# EAGLE design Voicecard-4P-v01 (EAGLE 5.09)
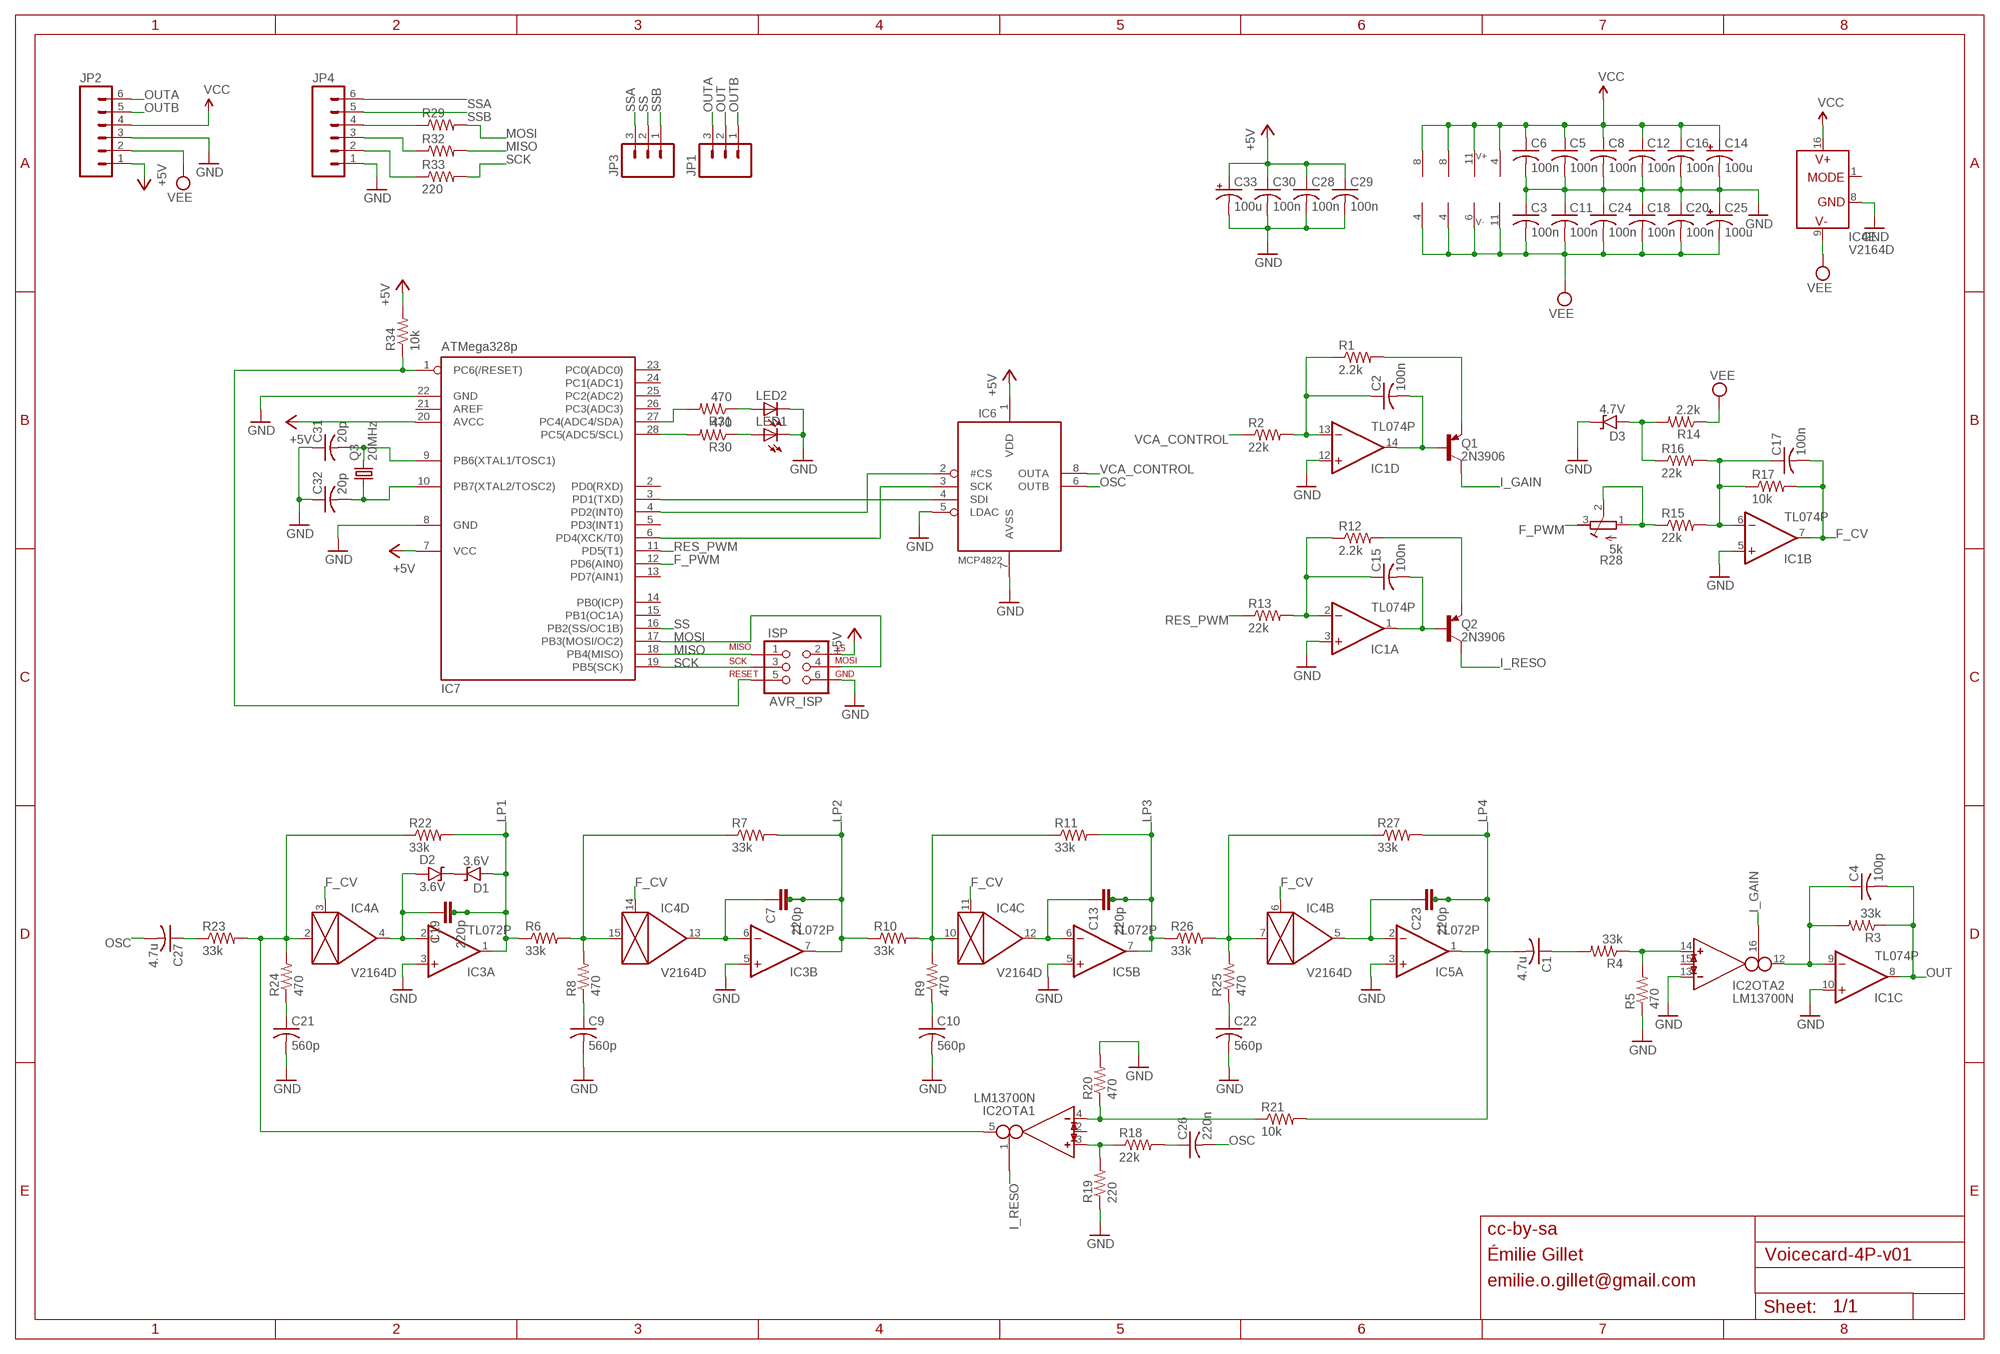
[diagram p0: schematic, sheet 1]

## Parts
C1  4.7u  C-US  [ENP11-6.3]
C2  100n  C-US025-025X050  [C025-025X050]
C3  100n  C-US025-025X050  [C025-025X050]
C4  100p  C-US025-025X050  [C025-025X050]
C5  100n  C-US025-025X050  [C025-025X050]
C6  100n  C-US025-025X050  [C025-025X050]
C7  220p  C-2.5-5/4  [C2.5/5-4]
C8  100n  C-US025-025X050  [C025-025X050]
C9  560p  C-US025-025X050  [C025-025X050]
C10  560p  C-US025-025X050  [C025-025X050]
C11  100n  C-US025-025X050  [C025-025X050]
C12  100n  C-US025-025X050  [C025-025X050]
C13  220p  C-2.5-5/4  [C2.5/5-4]
C14  100u  CPOL-USE2.5-6  [E2,5-6]
C15  100n  C-US025-025X050  [C025-025X050]
C16  100n  C-US025-025X050  [C025-025X050]
C17  100n  C-US025-025X050  [C025-025X050]
C18  100n  C-US025-025X050  [C025-025X050]
C19  220p  C-2.5-5/4  [C2.5/5-4]
C20  100n  C-US025-025X050  [C025-025X050]
C21  560p  C-US025-025X050  [C025-025X050]
C22  560p  C-US025-025X050  [C025-025X050]
C23  220p  C-2.5-5/4  [C2.5/5-4]
C24  100n  C-US025-025X050  [C025-025X050]
C25  100u  CPOL-USE2.5-6  [E2,5-6]
C26  220n  C-US025-025X050  [C025-025X050]
C27  4.7u  C-US  [ENP11-6.3]
C28  100n  C-US025-025X050  [C025-025X050]
C29  100n  C-US025-025X050  [C025-025X050]
C30  100n  C-US025-025X050  [C025-025X050]
C31  20p  C-US025-025X050  [C025-025X050]
C32  20p  C-US025-025X050  [C025-025X050]
C33  100u  CPOL-USE2.5-6  [E2,5-6]
D1  3.6V  1N47XXDO35  [D-5]
D2  3.6V  1N47XXDO35  [D-5]
D3  4.7V  1N47XXDO35  [D-5]
IC1  TL074P  [DIL14]
IC2  LM13700N  [DIL16]
IC3  TL072P  [DIL08]
IC4  V2164D  SSM2164P  [DIL16]
IC5  TL072P  [DIL08]
IC6  MCP4822  [DIL08]
IC7  ATMega328p  MEGA8-P  [DIL28-3]
ISP  AVR_ISP  AVR_SPI_PRG_6PTH  [2X3]
JP1  M03PTH  [1X03]
JP2  M06SIP  [1X06]
JP3  M03PTH  [1X03]
JP4  M06SIP  [1X06]
LED1  LED3MM  [LED3MM]
LED2  LED3MM  [LED3MM]
Q1  2N3906  2N3906-  [TO92-]
Q2  2N3906  2N3906-  [TO92-]
Q3  20MHz  CRYSTALHC49U-V  [HC49U-V]
R1  2.2k  R-US_0204/7  [0204/7]
R2  22k  R-US_0204/7  [0204/7]
R3  33k  R-US_0204/7  [0204/7]
R4  33k  R-US_0204/7  [0204/7]
R5  470  R-US_0204/7  [0204/7]
R6  33k  R-US_0204/7  [0204/7]
R7  33k  R-US_0204/7  [0204/7]
R8  470  R-US_0204/7  [0204/7]
R9  470  R-US_0204/7  [0204/7]
R10  33k  R-US_0204/7  [0204/7]
R11  33k  R-US_0204/7  [0204/7]
R12  2.2k  R-US_0204/7  [0204/7]
R13  22k  R-US_0204/7  [0204/7]
R14  2.2k  R-US_0204/7  [0204/7]
R15  22k  R-US_0204/7  [0204/7]
R16  22k  R-US_0204/7  [0204/7]
R17  10k  R-US_0204/7  [0204/7]
R18  22k  R-US_0204/7  [0204/7]
R19  220  R-US_0204/7  [0204/7]
R20  470  R-US_0204/7  [0204/7]
R21  10k  R-US_0204/7  [0204/7]
R22  33k  R-US_0204/7  [0204/7]
R23  33k  R-US_0204/7  [0204/7]
R24  470  R-US_0204/7  [0204/7]
R25  470  R-US_0204/7  [0204/7]
R26  33k  R-US_0204/7  [0204/7]
R27  33k  R-US_0204/7  [0204/7]
R28  5k  R-TRIMM3296P  [RTRIM3296P]
R29  220  R-US_0204/7  [0204/7]
R30  470  R-US_0204/7  [0204/7]
R31  470  R-US_0204/7  [0204/7]
R32  220  R-US_0204/7  [0204/7]
R33  220  R-US_0204/7  [0204/7]
R34  10k  R-US_0204/7  [0204/7]

## Nets
+5V: C28.1 C29.1 C30.1 C33.+ IC6.1(VDD) IC7.7(VCC) IC7.20(AVCC) ISP.2 JP2.1 R34.2
CAP_IN: C19.1 D2.A IC3.2(A:-IN) IC4.4(A:OUT)
F_CV: C17.2 IC1.7(B:OUT) IC4.3(A:CTRL) IC4.6(B:CTRL) IC4.11(C:CTRL) IC4.14(D:CTRL) R17.2
F_PWM: IC7.12(PD6(AIN0)) R28.3(A)
GND: C3.1 C5.2 C6.2 C8.2 C9.2 C10.2 C11.1 C12.2 C14.- C16.2 C18.1 C20.1 C21.2 C22.2 C24.1 C25.+ C28.2 C29.2 C30.2 C31.1 C32.1 C33.- D3.C IC1.3(A:+IN) IC1.5(B:+IN) IC1.10(C:+IN) IC1.12(D:+IN) IC2.13(OTA2:IN_N) IC3.3(A:+IN) IC3.5(B:+IN) IC4.8(E:GND) IC5.3(A:+IN) IC5.5(B:+IN) IC6.5(LDAC) IC6.7(AVSS) IC7.8(GND) IC7.22(GND) ISP.6 JP2.3 JP4.1 LED1.K(C) LED2.K(C) R5.1 R19.1 R20.2
I_GAIN: IC2.16(OTA2:I_BIAS) Q1.1(C)
I_RESO: IC2.1(OTA1:I_BIAS) Q2.1(C)
LEDS0: IC7.28(PC5(ADC5/SCL)) R30.2
LP1: C19.2 C19.3 D1.A IC3.1(A:OUT) R6.1 R22.2
LP2: C7.2 C7.3 IC3.7(B:OUT) R7.2 R10.1
LP3: C13.2 C13.3 IC5.7(B:OUT) R11.2 R26.1
LP4: C1.- C23.2 C23.3 IC5.1(A:OUT) R21.2 R27.2
MISO: IC7.18(PB4(MISO)) ISP.1 R32.2
MOSI: IC7.17(PB3(MOSI/OC2)) ISP.4 R29.2
N$1: C27.+ R23.1
N$2: C1.+ R4.2
N$3: IC6.4(SDI) IC7.3(PD1(TXD))
N$5: C21.1 R24.1
N$7: LED1.A R30.1
N$8: JP4.2 R33.1
N$9: D3.A R14.2 R16.1
N$10: LED2.A R31.1
N$11: IC7.27(PC4(ADC4/SDA)) R31.2
N$12: C7.1 IC3.6(B:-IN) IC4.13(D:OUT)
N$13: JP4.3 R32.1
N$14: IC7.1(PC6(/RESET)) ISP.5 R34.1
N$15: IC6.3(SCK) IC7.6(PD4(XCK/T0))
N$16: IC6.2(#CS) IC7.4(PD2(INT0))
N$17: C13.1 IC4.12(C:OUT) IC5.6(B:-IN)
N$18: JP4.4 R29.1
N$19: IC4.10(C:IN) R9.2 R10.2 R11.1
N$20: C10.1 R9.1
N$21: C22.1 R25.1
N$22: IC4.7(B:IN) R25.2 R26.2 R27.1
N$23: C23.1 IC4.5(B:OUT) IC5.2(A:-IN)
N$26: C9.1 R8.1
N$29: C2.2 IC1.14(D:OUT) Q1.2(B)
N$30: C15.2 IC1.1(A:OUT) Q2.2(B)
N$32: IC2.4(OTA1:IN_N) R20.1 R21.1
N$33: IC2.5(OTA1:OUT) IC4.2(A:IN) R22.1 R23.2 R24.2
N$34: IC2.3(OTA1:IN_P) R18.1 R19.2
N$36: C26.1 R18.2
N$37: IC2.14(OTA2:IN_P) R4.1 R5.2
N$40: C17.1 IC1.6(B:-IN) R15.2 R16.2 R17.1
N$41: R15.1 R28.1(E) R28.2(S)
N$42: D1.C D2.C
N$43: IC4.15(D:IN) R6.2 R7.1 R8.2
N$51: C15.1 IC1.2(A:-IN) R12.1 R13.2
N$57: C2.1 IC1.13(D:-IN) R1.1 R2.2
N$60: Q1.3(E) R1.2
N$68: Q2.3(E) R12.2
N$70: C4.1 IC1.9(C:-IN) IC2.12(OTA2:OUT) R3.2
N$82: C32.2 IC7.10(PB7(XTAL2/TOSC2)) Q3.1
N$83: C31.2 IC7.9(PB6(XTAL1/TOSC1)) Q3.2
OSC: C26.2 C27.- IC6.6(OUTB)
OUT: C4.2 IC1.8(C:OUT) JP1.2 R3.1
OUTA: JP1.3 JP2.6
OUTB: JP1.1 JP2.5
RES_PWM: IC7.11(PD5(T1)) R13.1
SCK: IC7.19(PB5(SCK)) ISP.3 R33.2
SS: IC7.16(PB2(SS/OC1B)) JP3.2
SSA: JP3.3 JP4.6
SSB: JP3.1 JP4.5
VCA_CONTROL: IC6.8(OUTA) R2.1
VCC: C5.1 C6.1 C8.1 C12.1 C14.+ C16.1 IC1.4(P:V+) IC2.11(SUPPLY:V+) IC3.8(P:V+) IC4.16(E:V+) IC5.8(P:V+) JP2.4
VEE: C3.2 C11.2 C18.2 C20.2 C24.2 C25.- IC1.11(P:V-) IC2.6(SUPPLY:V-) IC3.4(P:V-) IC4.9(E:V-) IC5.4(P:V-) JP2.2 R14.1
Unconnected: IC2.2(OTA1:I_DIODE) IC2.7(BUF1:B) IC2.8(BUF1:E) IC2.9(BUF2:E) IC2.10(BUF2:B) IC2.15(OTA2:I_DIODE) IC4.1(E:MODE) IC7.2(PD0(RXD)) IC7.5(PD3(INT1)) IC7.13(PD7(AIN1)) IC7.14(PB0(ICP)) IC7.15(PB1(OC1A)) IC7.21(AREF) IC7.23(PC0(ADC0)) IC7.24(PC1(ADC1)) IC7.25(PC2(ADC2)) IC7.26(PC3(ADC3))

## Notes on the sheet
- cc-by-sa
- Émilie Gillet
- emilie.o.gillet@gmail.com

## Library data of the parts
C1 C27 = og-rcl:C-US
C2-C6 C8-C12 C15-C18 C20-C22 C24 C26 C28-C32 = rcl:C-US: CAPACITOR, American symbol
C7 C13 C19 C23 = capacitor-wima:C-: CAPACITOR for alternative placement naming: default grid - extended grid/package width
C14 C25 C33 = rcl:CPOL-US: POLARIZED CAPACITOR, American symbol
D1-D3 = og-diodes:1N47XX: Zener Diode 1N4728 - 1N4764: 3.3 V - 100V, 10% (1n47xxA 5%); DO-41 glass case
IC1 = linear:TL074: OP AMP
IC2 = ota:LM13700: Dual OTA with buffers
IC3 IC5 = og-linear:TL072: OP AMP
IC4 = ssm2164:SSM2164
IC6 = og-dac:MCP4822
IC7 = atmel:MEGA8-P: MICROCONTROLLER 8 Kbytes FLASH, 1 kbytes SRAM, 512 bytes EEPROM, USART, 4-channel 10 bit ADC, 2-channel 8 bit ADC Pin compatible with Atmega48, ATMega88, ATMega168 Source: avr.lbr
ISP = SparkFun:AVR_SPI_PRG_6: AVR ISP 6 Pin This is the reduced ISP connector for AVR programming. Common on Arduino. This footprint will take up less PCB space and can be used with a 10-pin to 6-pin adapter such as SKU: BOB-08508
JP1 JP3 = SparkFun:M03: Header 3 Standard 3-pin 0.1" header. Use with straight break away headers (SKU : PRT-00116), right angle break away headers (PRT-00553), swiss pins (PRT-00743), machine pins (PRT-00117), and female headers (PRT-00115). Molex polarized connector foot print use with SKU : PRT-08232 with associated crimp pins and housings.
JP2 JP4 = SparkFun:M06: Header 6 Standard 6-pin 0.1" header. Use with straight break away headers (SKU : PRT-00116), right angle break away headers (PRT-00553), swiss pins (PRT-00743), machine pins (PRT-00117), and female headers (PRT-00115). Molex polarized connector foot print use with SKU : PRT-08094 with associated crimp pins and housings. NOTES ON THE VARIANTS LOCK and LOCK_LONGPADS... This footprint was designed to help hold the alignment of a through-hole component (i.e. 6-pin header) while soldering it into place. You may notice that each hole has been shifted either up or down by 0.005 of an inch from it's more standard position (which is a perfectly straight line). This slight alteration caused the pins (the squares in the middle) to touch the edges of the holes. Because they are alternating, it causes a "brace" to hold the component in place. 0.005 has proven to be the perfect amount of "off-center" position when using our standard breakaway headers. Although looks a little odd when you look at the bare footprint, once you have a header in there, the alteration is very hard to notice. Also, if you push a header all the way into place, it is covered up entirely on the bottom side. This idea of altering the position of holes to aid alignment will be further integrated into the Sparkfun Library for other footprints. It can help hold any component with 3 or more connection pins.
LED1 LED2 = led:LED: LED OSRAM: - CHIPLED LG R971, LG N971, LY N971, LG Q971, LY Q971, LO R971, LY R971 LH N974, LH R974 LS Q976, LO Q976, LY Q976 LO Q996 - Hyper CHIPLED LW Q18S LB Q993, LB Q99A, LB R99A - SideLED LS A670, LO A670, LY A670, LG A670, LP A670 LB A673, LV A673, LT A673, LW A673 LH A674 LY A675 LS A676, LA A676, LO A676, LY A676, LW A676 LS A679, LY A679, LG A679 - Hyper Micro SIDELED® LS Y876, LA Y876, LO Y876, LY Y876 LT Y87S - SmartLED LW L88C, LW L88S LB L89C, LB L89S, LG L890 LS L89K, LO L89K, LY L89K LS L896, LA L896, LO L896, LY L896 - TOPLED LS T670, LO T670, LY T670, LG T670, LP T670 LSG T670, LSP T670, LSY T670, LOP T670, LYG T670 LG T671, LOG T671, LSG T671 LB T673, LV T673, LT T673, LW T673 LH T674 LS T676, LA T676, LO T676, LY T676, LB T676, LH T676, LSB T676, LW T676 LB T67C, LV T67C, LT T67C, LS T67K, LO T67K, LY T67K, LW E67C LS E67B, LA E67B, LO E67B, LY E67B, LB E67C, LV E67C, LT E67C LW T67C LS T679, LY T679, LG T679 LS T770, LO T770, LY T770, LG T770, LP T770 LB T773, LV T773, LT T773, LW T773 LH T774 LS E675, LA E675, LY E675, LS T675 LS T776, LA T776, LO T776, LY T776, LB T776 LHGB T686 LT T68C, LB T68C - Hyper Mini TOPLED® LB M676 - Mini TOPLED Santana® LG M470 LS M47K, LO M47K, LY M47K Source: http://www.osram.convergy.de LUXEON: - LUMILED® LXK2-PW12-R00, LXK2-PW12-S00, LXK2-PW14-U00, LXK2-PW14-V00 LXK2-PM12-R00, LXK2-PM12-S00, LXK2-PM14-U00 LXK2-PE12-Q00, LXK2-PE12-R00, LXK2-PE12-S00, LXK2-PE14-T00, LXK2-PE14-U00 LXK2-PB12-K00, LXK2-PB12-L00, LXK2-PB12-M00, LXK2-PB14-N00, LXK2-PB14-P00, LXK2-PB14-Q00 LXK2-PR12-L00, LXK2-PR12-M00, LXK2-PR14-Q00, LXK2-PR14-R00 LXK2-PD12-Q00, LXK2-PD12-R00, LXK2-PD12-S00 LXK2-PH12-R00, LXK2-PH12-S00 LXK2-PL12-P00, LXK2-PL12-Q00, LXK2-PL12-R00 Source: www.luxeon.com KINGBRIGHT: KA-3528ASYC Source: www.kingbright.com
Q1 Q2 = gm-trans:2N3906: PNP Transistor
Q3 = crystal:CRYSTAL: CRYSTAL
R1-R27 R29-R34 = rcl:R-US_: RESISTOR, American symbol
R28 = rcl:R-TRIMM: Trimm resistor

## Board
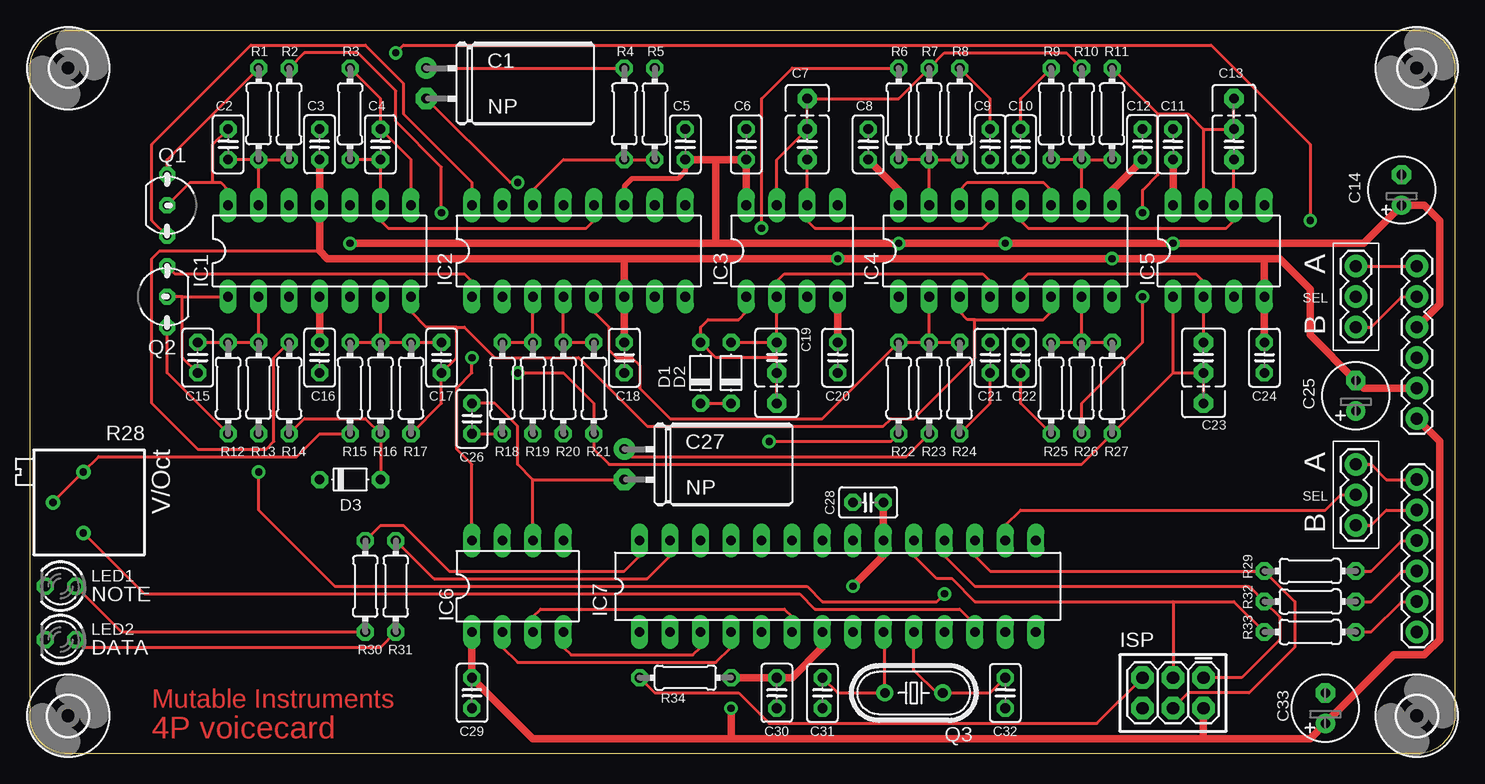
[diagram p1: board, top side]
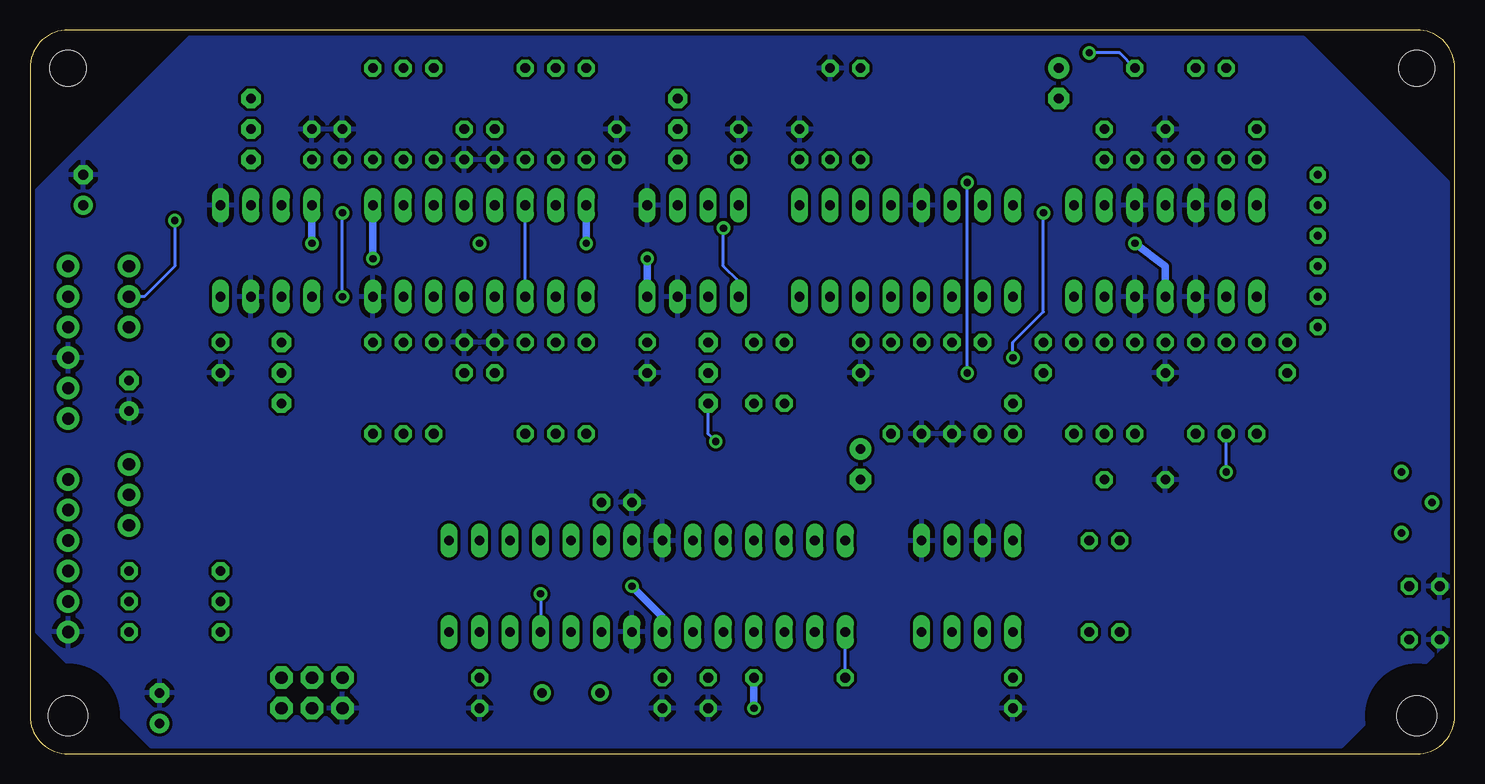
[diagram p2: board, bottom side, seen from below]

Size 118.75 x 60.33 mm. Coordinates in mm from the lower left corner, seen from the top.
Outline: 0,57.15 arc-90 3.18,60.33 115.57,60.33 arc-90 118.75,57.15 118.75,3.17 arc-90 115.57,0 3.18,0 arc-90 0,3.17 0,57.15
Copper layers (1*16): Top 0.035mm / dielectric 1.5mm / Bottom 0.035mm
Design rules "SparkFun *": minimum track width 8mil, minimum drill 20mil, track to track 8mil, track to pad 8mil, pad to pad 8mil, via to via 8mil, smd to smd 8mil, copper to edge 10mil, drill to drill 8mil, minimum pad ring 12mil, minimum via ring 10mil, stop-mask expansion 4mil, vias tented up to drill 25mil, thermal gap 16mil

### Footprints (pad centres in the part's own frame; a part is rotated, then mirrored left to right if it is on the bottom)
ENP11-6.3 = drill 0.813 pad 1.778 round: + -2.54,1.27 | drill 0.813 pad 1.778 octagon: - -2.54,-1.27
C025-025X050 = drill 0.813 octagon: 1 -1.27,0; 2 1.27,0
C2.5/5-4 = drill 0.813 pad 1.6 octagon: 1 -1.27,0; 2 1.27,0; 3 3.81,0
E2,5-6 = drill 0.813 pad 1.6 round: + -1.27,0 | drill 0.813 pad 1.6 octagon: - 1.27,0
D-5 = drill 0.813 octagon: A 2.54,0; C -2.54,0
DIL14 = drill 0.813 long: 1 -7.62,-3.81; 2 -5.08,-3.81; 3 -2.54,-3.81; 4 0,-3.81; 5 2.54,-3.81; 6 5.08,-3.81; 7 7.62,-3.81; 8 7.62,3.81; 9 5.08,3.81; 10 2.54,3.81; 11 0,3.81; 12 -2.54,3.81; 13 -5.08,3.81; 14 -7.62,3.81
DIL16 = drill 0.813 long: 1 -8.89,-3.81; 2 -6.35,-3.81; 3 -3.81,-3.81; 4 -1.27,-3.81; 5 1.27,-3.81; 6 3.81,-3.81; 7 6.35,-3.81; 8 8.89,-3.81; 9 8.89,3.81; 10 6.35,3.81; 11 3.81,3.81; 12 1.27,3.81; 13 -1.27,3.81; 14 -3.81,3.81; 15 -6.35,3.81; 16 -8.89,3.81
DIL08 = drill 0.813 pad 1.27 long: 1 -3.81,-3.81; 2 -1.27,-3.81; 3 1.27,-3.81; 4 3.81,-3.81; 5 3.81,3.81; 6 1.27,3.81; 7 -1.27,3.81; 8 -3.81,3.81
DIL08' = drill 0.813 long: 1 -3.81,-3.81; 2 -1.27,-3.81; 3 1.27,-3.81; 4 3.81,-3.81; 5 3.81,3.81; 6 1.27,3.81; 7 -1.27,3.81; 8 -3.81,3.81
DIL28-3 = drill 0.813 long: 1 -16.51,-3.81; 2 -13.97,-3.81; 3 -11.43,-3.81; 4 -8.89,-3.81; 5 -6.35,-3.81; 6 -3.81,-3.81; 7 -1.27,-3.81; 8 1.27,-3.81; 9 3.81,-3.81; 10 6.35,-3.81; 11 8.89,-3.81; 12 11.43,-3.81; 13 13.97,-3.81; 14 16.51,-3.81; 15 16.51,3.81; 16 13.97,3.81; 17 11.43,3.81; 18 8.89,3.81; 19 6.35,3.81; 20 3.81,3.81; 21 1.27,3.81; 22 -1.27,3.81; 23 -3.81,3.81; 24 -6.35,3.81; 25 -8.89,3.81; 26 -11.43,3.81; 27 -13.97,3.81; 28 -16.51,3.81
2X3 = drill 1.016 pad 1.88 octagon: 1 0,0; 2 0,2.54; 3 2.54,0; 4 2.54,2.54; 5 5.08,0; 6 5.08,2.54
1X03 = drill 1.016 pad 1.88 round: 1 0,0; 2 2.54,0; 3 5.08,0
1X06 = drill 1.016 pad 1.88 round: 1 0,0; 2 2.54,0; 3 5.08,0; 4 7.62,0; 5 10.16,0; 6 12.7,0
LED3MM = drill 0.813 octagon: A -1.27,0; K 1.27,0
TO92- = drill 0.7 octagon: 1 2.54,0; 2 0,0; 3 -2.54,0
HC49U-V = drill 0.813 round: 1 -2.413,0; 2 2.413,0
0204/7 = drill 0.813 octagon: 1 -3.81,0; 2 3.81,0
RTRIM3296P = drill 0.61 round: 1 0,-2.54; 2 2.54,0; 3 0,2.54
3,0 = hole 3: 0,0
3,3 = hole 3.3: 0,0

### Placement (x,y rotation side)
C1  35.56,55.88 0 top
C2  16.51,50.8 90 top
C3  24.13,50.8 270 top
C4  29.21,50.8 90 top
C5  54.61,50.8 90 top
C6  59.69,50.8 90 top
C7  64.77,50.8 90 top
C8  69.85,50.8 90 top
C9  80.01,50.8 270 top
C10  82.55,50.8 270 top
C11  92.71,50.8 270 top
C12  95.25,50.8 90 top
C13  100.33,50.8 90 top
C14  114.3,46.99 90 top
C15  13.97,33.02 270 top
C16  24.13,33.02 270 top
C17  34.29,33.02 270 top
C18  49.53,33.02 90 top
C19  62.23,33.02 270 top
C20  67.31,33.02 90 top
C21  80.01,33.02 90 top
C22  82.55,33.02 90 top
C23  97.79,33.02 270 top
C24  102.87,33.02 90 top
C25  110.49,29.84 90 top
C26  36.83,27.94 90 top
C27  52.07,24.13 0 top
C28  69.85,20.95 180 top
C29  36.83,5.08 270 top
C30  62.23,5.08 270 top
C31  66.04,5.08 90 top
C32  81.28,5.08 90 top
C33  107.95,3.81 90 top
D1  55.88,31.75 90 top
D2  58.42,31.75 90 top
D3  26.67,22.86 0 top
IC1  24.13,41.91 0 top
IC2  45.72,41.91 0 top
IC3  63.5,41.91 0 top
IC4  81.28,41.91 0 top
IC5  99.06,41.91 0 top
IC6  MCP4822  [DIL08']  40.64,13.97 0 top
IC7  67.31,13.97 0 top
ISP  97.79,6.35 180 top
JP1  110.49,35.56 90 top
JP2  115.57,27.94 90 top
JP3  110.49,19.05 90 top
JP4  115.57,10.16 90 top
LED1  2.54,13.97 180 top
LED2  2.54,9.53 180 top
Q1  11.43,45.72 270 top
Q2  11.43,38.1 90 top
Q3  73.66,5.08 180 top
R1  19.05,53.34 90 top
R2  21.59,53.34 270 top
R3  26.67,53.34 270 top
R4  49.53,53.34 90 top
R5  52.07,53.34 270 top
R6  72.39,53.34 270 top
R7  74.93,53.34 90 top
R8  77.47,53.34 270 top
R9  85.09,53.34 270 top
R10  87.63,53.34 270 top
R11  90.17,53.34 90 top
R12  16.51,30.48 270 top
R13  19.05,30.48 90 top
R14  21.59,30.48 270 top
R15  26.67,30.48 90 top
R16  29.21,30.48 90 top
R17  31.75,30.48 270 top
R18  39.37,30.48 270 top
R19  41.91,30.48 90 top
R20  44.45,30.48 270 top
R21  46.99,30.48 270 top
R22  72.39,30.48 270 top
R23  74.93,30.48 90 top
R24  77.47,30.48 90 top
R25  85.09,30.48 90 top
R26  87.63,30.48 90 top
R27  90.17,30.48 270 top
R28  4.45,20.95 180 top
R29  106.68,15.24 180 top
R30  27.94,13.97 90 top
R31  30.48,13.97 90 top
R32  106.68,12.7 180 top
R33  106.68,10.16 180 top
R34  54.61,6.35 0 top
U$1  [3,0]  3.18,57.15 0 top
U$2  [3,0]  115.57,57.15 0 top
U$4  [3,3]  3.18,3.17 0 top
U$5  [3,3]  115.57,3.17 0 top
U$6  [V2_LOGO_SMALL]  8.26,-3.81 0 top  (outside the outline)

### Tracks (layer width: path | path; a pad name or v marks a point on that pad's centre or on a via)
+5V  (via drill 0.6)
  Top 0.61: v68.58,13.97 71.12,16.51 IC7.20 C28.1 | 58.42,1.27 41.91,1.27 C29.1 IC6.1 | 58.42,1.27 97.79,1.27 | 97.79,1.27 106.68,1.27 C33.+ 113.67,8.26 116.2,8.26 117.48,9.53 117.48,26.04 JP2.1 | R34.2 C30.1 63.5,6.35 66.04,8.89 IC7.7 | 58.42,1.27 v58.42,3.81 | 97.79,1.27 ISP.2
  Bottom 0.61: v68.58,13.97 66.04,11.43 IC7.7 | v58.42,3.81 R34.2
CAP_IN
  Top 0.254: IC4.4 80.01,39.37 79.38,40.01 62.87,40.01 62.23,39.37 IC3.2 C19.1 D2.A
F_CV
  Top 0.254: IC1.7 31.75,36.83 33.02,35.56 35.56,35.56 | R17.2 34.29,29.21 C17.2 35.56,33.02 35.56,35.56 | IC4.11 85.09,46.99 84.45,47.62 78.11,47.62 77.47,46.99 IC4.14 | IC4.3 77.47,36.83 78.11,36.2 78.74,36.2 | 78.74,36.2 78.74,33.02 73.66,27.94 71.76,27.94 71.12,27.3 51.43,27.3 45.72,33.02 38.73,33.02 36.2,35.56 35.56,35.56 | IC4.6 85.09,36.83 84.45,36.2 78.74,36.2
  Bottom 0.254: IC4.3 IC4.14
F_PWM
  Top 0.254: IC7.12 78.74,10.79 77.47,12.06 65.41,12.06 64.14,13.34 9.53,13.34 R28.3
GND
  pour Bottom (isolate 0.254): 0.64,47.62 0.64,9.53 9.53,0.64 108.59,0.64 118.11,10.16 118.11,46.99 105.41,59.69 12.7,59.69
I_GAIN
  Top 0.254: Q1.1 10.16,44.45 10.16,50.8 18.41,59.05 27.94,59.05 31.11,55.88 31.11,53.34 36.83,47.62 IC2.16
I_RESO
  Top 0.254: IC2.1 36.83,39.37 36.2,40.01 12.07,40.01 Q2.1
LEDS0
  Top 0.254: R30.2 29.21,19.05 31.11,19.05 34.92,15.24 49.53,15.24 50.8,16.51 IC7.28
LP1  (via drill 0.6)
  Top 0.254: R6.1 63.5,57.15 60.96,54.61 v60.96,43.81 | C19.3 C19.2 62.23,33.02 57.15,33.02 D1.A 55.88,35.56 56.51,36.2 59.05,36.2 59.69,36.83 IC3.1 | R22.2 71.76,26.04 62.87,26.04 v61.59,26.04
  Bottom 0.254: v60.96,43.81 60.96,40.64 59.69,39.37 IC3.1 | v61.59,26.04 62.23,26.67 C19.3
LP2
  Top 0.254: IC3.7 62.23,49.53 C7.2 C7.3 72.39,54.61 R7.2 76.2,58.42 86.36,58.42 R10.1
LP3  (via drill 0.6)
  Top 0.254: C13.3 C13.2 97.79,52.07 | 97.79,52.07 IC5.7 | 93.98,53.34 R11.2 | 93.98,53.34 96.52,53.34 97.79,52.07 | R26.1 87.63,29.21 92.71,34.29 v92.71,38.1 | v92.71,45.09 92.71,46.99 93.98,48.26 93.98,53.34
  Bottom 0.254: v92.71,38.1 v92.71,45.09
LP4  (via drill 0.6)
  Top 0.254: C23.3 C23.2 95.25,31.75 | 95.25,31.75 IC5.1 | 95.25,31.75 R27.2 87.63,24.13 48.26,24.13 46.99,25.4 R21.2 46.99,29.21 44.45,31.75 v40.64,31.75 | C1.- 40,47.62 v40.64,47.62
  Bottom 0.254: v40.64,31.75 v40.64,47.62
MISO
  Top 0.254: IC7.18 76.2,16.51 78.74,13.97 101.6,13.97 R32.2 104.14,11.43 104.14,9.53 100.97,6.35 ISP.1
MOSI
  Top 0.254: IC7.17 78.74,16.51 80.01,15.24 R29.2 105.41,12.7 105.41,8.89 101.6,5.08 96.52,5.08 ISP.4
N$1
  Top 0.254: C27.+ 50.16,24.77 73.03,24.77 R23.1
N$2
  Top 0.254: C1.+ R4.2
N$3
  Top 0.254: IC7.3 55.88,8.89 55.24,8.26 45.08,8.26 44.45,8.89 IC6.4
N$5
  Top 0.254: C21.1 80.01,29.21 R24.1
N$7
  Top 0.254: R30.1 7.62,10.16 LED1.A
N$8
  Top 0.254: R33.1 111.76,10.16 114.3,12.7 JP4.2
N$9
  Top 0.254: R14.2 22.86,27.94 27.94,27.94 R16.1 D3.A
N$10
  Top 0.254: R31.1 29.21,8.89 4.45,8.89 LED2.A
N$11
  Top 0.254: R31.2 33.65,14.61 51.43,14.61 53.34,16.51 IC7.27
N$12
  Top 0.254: IC4.13 80.01,44.45 79.38,43.81 65.41,43.81 64.77,44.45 IC3.6 C7.1
N$13
  Top 0.254: R32.1 111.76,12.7 114.3,15.24 JP4.3
N$14
  Top 0.254: R34.1 52.07,5.08 59.05,5.08 61.59,2.54 88.9,2.54 ISP.5
  Bottom 0.254: R34.1 IC7.1
N$15
  Top 0.254: IC7.6 63.5,11.43 62.87,12.06 42.54,12.06 41.91,11.43 IC6.3
N$16
  Top 0.254: IC7.4 58.42,8.89 57.15,7.62 40.64,7.62 39.37,8.89 IC6.2
N$17
  Top 0.254: C13.1 IC5.6 100.33,44.45 99.7,43.81 83.19,43.81 82.55,44.45 IC4.12
N$18
  Top 0.254: R29.1 111.76,15.24 114.3,17.78 JP4.4
N$19
  Top 0.254: R10.2 R9.2 | R10.2 R11.1 | IC4.10 R10.2
N$20
  Top 0.254: R9.1 82.55,54.61 C10.1
N$21
  Top 0.254: C22.1 82.55,29.21 R25.1
N$22
  Top 0.254: R25.2 R26.2 | R26.2 R27.1 | R26.2 IC4.7
N$23
  Top 0.254: C23.1 IC5.2 97.79,39.37 97.16,40.01 83.19,40.01 82.55,39.37 IC4.5
N$26
  Top 0.254: R8.1 80.01,54.61 C9.1
N$29
  Top 0.254: IC1.14 16.51,46.99 15.88,47.62 15.24,47.62 | 15.24,47.62 15.24,50.8 C2.2 | Q1.2 13.34,47.62 15.24,47.62
N$30
  Top 0.254: C15.2 12.7,33.02 12.7,38.1 | 12.7,38.1 Q2.2 | 12.7,38.1 IC1.1
N$32
  Top 0.254: IC2.4 R20.1 R21.1
N$33
  Top 0.254: R23.2 IC4.2 | R23.2 R24.2 | R23.2 R22.1 66.04,27.94 53.34,27.94 50.8,30.48 50.8,32.38 50.16,33.02 48.89,33.02 48.26,33.66 48.26,35.56 46.99,36.83 IC2.5
N$34
  Top 0.254: R18.1 R19.2 IC2.3
N$36
  Top 0.254: C26.1 R18.2
N$37
  Top 0.254: R5.2 R4.1 44.45,49.53 41.91,46.99 IC2.14
N$40
  Top 0.254: R16.2 IC1.6 | R15.2 R16.2 | R16.2 R17.1 C17.1
N$41
  Top 0.254: R28.2 R28.1 5.71,24.77 22.23,24.77 24.13,26.67 R15.1
N$42
  Top 0.254: D1.C D2.C
N$43
  Top 0.254: R7.1 R6.2 | IC4.15 R7.1 | R7.1 R8.2
N$51
  Top 0.254: IC1.2 R13.2 R12.1 C15.1
N$57
  Top 0.254: IC1.13 R1.1 | R1.1 R2.2 | R1.1 C2.1
N$60
  Top 0.254: Q1.3 11.43,49.53 R1.2
N$68
  Top 0.254: R12.2 11.43,31.75 Q2.3
N$70
  Top 0.254: R3.2 C4.1 IC1.9 29.21,44.45 29.84,43.81 46.35,43.81 46.99,44.45 IC2.12
N$82
  Top 0.254: IC7.10 73.66,6.99 75.56,5.08 Q3.1 80.01,5.08 C32.2
N$83
  Top 0.254: IC7.9 71.25,10.03 Q3.2 67.31,5.08 C31.2
OSC
  Top 0.254: 41.91,22.86 C27.- | IC6.6 41.91,22.86 | C26.2 38.73,29.21 40.64,27.3 40.64,24.13 41.91,22.86
OUT  (via drill 0.6)
  Top 0.254: R3.1 29.21,54.61 C4.2 31.75,49.53 IC1.8 | v106.68,44.45 106.68,50.8 98.42,59.05 31.11,59.05 v30.48,58.42
  Bottom 0.254: JP1.2 109.22,38.1 106.68,40.64 v106.68,44.45 | v30.48,58.42 27.94,58.42 R3.1
OUTA
  Top 0.254: JP1.3 JP2.6
OUTB
  Top 0.254: JP1.1 111.76,35.56 114.3,38.1 JP2.5
RES_PWM  (via drill 0.6)
  Top 0.254: v76.2,13.34 75.56,12.7 66.04,12.7 64.77,13.97 25.4,13.97 19.05,20.32 v19.05,23.5
  Bottom 0.254: v76.2,13.34 IC7.11 | v19.05,23.5 R13.1
SCK
  Top 0.254: IC7.19 73.66,16.51 75.56,14.61 76.84,14.61 78.74,12.7 95.25,12.7 | 95.25,12.7 100.33,12.7 R33.2 | 95.25,12.7 ISP.3
SS
  Top 0.254: JP3.2 109.22,21.59 107.95,20.32 82.55,20.32 81.28,19.05 IC7.16
SSA
  Top 0.254: JP3.3 111.76,24.13 113.03,22.86 JP4.6
SSB
  Top 0.254: JP3.1 111.76,19.05 113.03,20.32 JP4.5
VCA_CONTROL  (via drill 0.6)
  Top 0.254: IC6.8 36.83,24.13 35.56,25.4 35.56,30.48 36.83,31.75 v36.83,33.02 | R2.1 22.86,58.42 27.3,58.42 30.48,55.24 30.48,52.7 34.29,48.9 v34.29,45.09
  Bottom 0.254: v36.83,33.02 36.83,34.29 34.29,36.83 v34.29,45.09
VCC  (via drill 0.6)
  Top 0.406: IC2.11 49.53,47.31 50.16,47.94 53.97,47.94 54.61,48.58 C5.1
  Top 0.61: JP2.4 117.48,37.47 117.48,44.45 116.2,45.72 C14.+ 111.12,42.55 v95.25,42.55 v81.28,42.55 v72.39,42.55 57.15,42.55 | C16.1 IC1.4 | IC5.8 C12.1 | C8.1 72.39,46.99 IC4.16 | IC3.8 C6.1 57.15,49.53 | v26.67,42.55 57.15,42.55 | 57.15,49.53 C5.1 | 57.15,42.55 57.15,49.53
  Bottom 0.61: v72.39,42.55 IC4.16 | v95.25,42.55 IC5.8 | v26.67,42.55 24.13,40.64 IC1.4
VEE  (via drill 0.6)
  Top 0.254: R14.1 20.32,33.02 20.32,26.04 19.68,25.4 13.97,25.4 10.16,29.21 10.16,41.27 10.79,41.91 24.13,41.91
  Top 0.61: C3.2 IC1.11 24.13,41.91 24.77,41.27 49.53,41.27 | C24.2 IC5.4 102.87,41.27 | C11.2 90.17,46.99 IC4.9 | IC3.4 C20.2 | JP2.2 111.12,30.48 C25.- 106.68,34.92 106.68,38.73 104.14,41.27 102.87,41.27 | 49.53,41.27 v67.31,41.27 v90.17,41.27 102.87,41.27 | 49.53,41.27 IC2.6 C18.2
  Bottom 0.61: v90.17,41.27 IC4.9 | v67.31,41.27 IC3.4

### Text on the board
Top: Mutable Instruments | 4P voicecard
tPlace: V/Oct
tNames: A | SEL | B | A | SEL | B | NOTE | DATA
tStop: Mutable Instruments | 4P voicecard
200bmp: cc-by-sa | Émilie Gillet | v0.1